# Altium schematic sheet CarteRelais.SchDoc
size A4
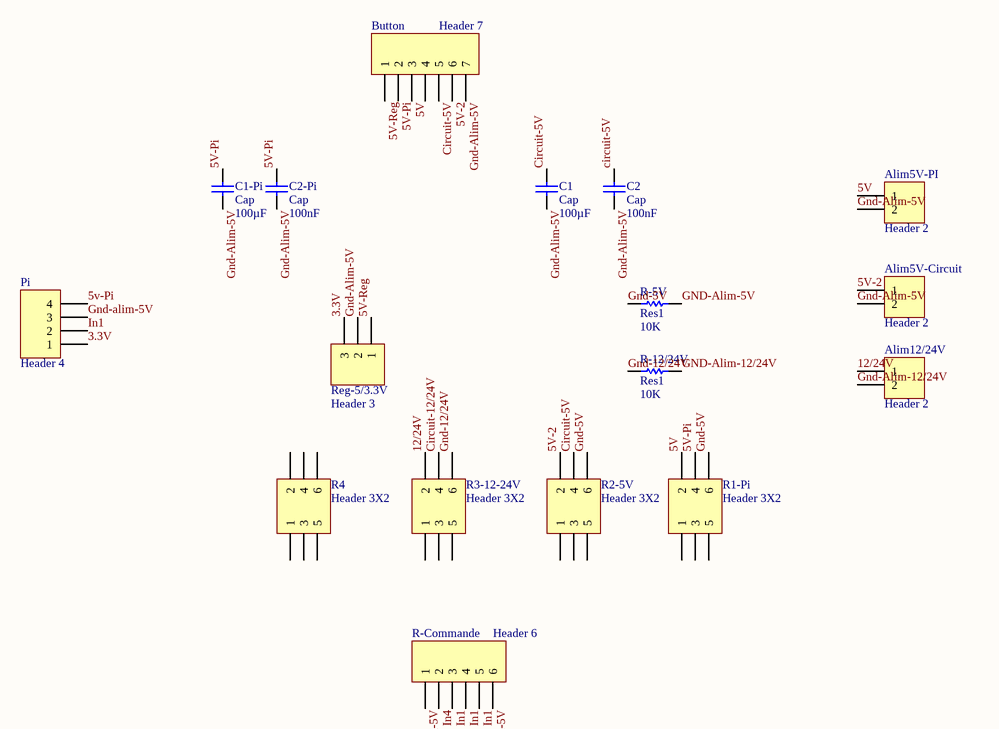
[diagram p0: CarteRelais.SchDoc]

## Parts
Alim5V-Circuit  Header 2  [HDR1X2]
Alim5V-PI  Header 2  [HDR1X2]
Alim12/24V  Header 2  [HDR1X2]
Button  Header 7  [HDR1X7]
C1  Cap  value 100µF  [RAD-0.3]
C1-Pi  Cap  value 100µF  [RAD-0.3]
C2  Cap  value 100nF  [RAD-0.3]
C2-Pi  Cap  value 100nF  [RAD-0.3]
Pi  Header 4  [HDR1X4]
R1-Pi  Header 3X2  [HDR2X3]
R2-5V  Header 3X2  [HDR2X3]
R3-12-24V  Header 3X2  [HDR2X3]
R4  Header 3X2  [HDR2X3]
R-5V  Res1  value 10K  [AXIAL-0.3]
R-12/24V  Res1  value 10K  [AXIAL-0.3]
R-Commande  Header 6  [HDR1X6]
Reg-5/3.3V  Header 3  [HDR1X3]

## Nets
3.3V: Pi.1 Reg-5/3.3V.3
5V: Alim5V-PI.1 Button.3 R1-Pi.2
5V-2: Alim5V-Circuit.1 Button.6 R2-5V.2
5V-Pi: Button.2 C1-Pi.2 C2-Pi.2 Pi.4 R1-Pi.4
5V-Reg: Button.1 Reg-5/3.3V.1
12/24V: Alim12/24V.1 R3-12-24V.2
Circuit-5V: Button.5 C1.2 C2.2 R2-5V.4 R-Commande.1
Circuit-12/24V: R3-12-24V.4
Gnd-5V: R1-Pi.6 R2-5V.6 R-5V.1
Gnd-12/24V: R3-12-24V.6 R-12/24V.1
GND-Alim-5V: Alim5V-Circuit.2 Alim5V-PI.2 Button.7 C1.1 C1-Pi.1 C2.1 C2-Pi.1 Pi.3 R-5V.2 R-Commande.6 Reg-5/3.3V.2
GND-Alim-12/24V: Alim12/24V.2 R-12/24V.2
In1: Pi.2 R-Commande.3 R-Commande.4 R-Commande.5
In4: R-Commande.2

Not connected (* = marked no-connect by the designer): Button 4; R1-Pi 1 3 5; R2-5V 1 3 5; R3-12-24V 1 3 5; R4 1 2 3 4 5 6

## Library data of the parts
Alim5V-Circuit Alim5V-PI Alim12/24V = Header 2: Header, 2-Pin; LatestRevisionDate: 17-Jul-2002; LatestRevisionNote: Re-released for DXP Platform.; Publisher: Altium Limited
Button = Header 7: Header, 7-Pin; LatestRevisionDate: 17-Jul-2002; LatestRevisionNote: Re-released for DXP Platform.; Publisher: Altium Limited
C1 C1-Pi C2 C2-Pi = Cap: Capacitor; Published: 8-Jun-2000; LatestRevisionDate: 17-Jul-2002; LatestRevisionNote: Re-released for DXP Platform.; PackageReference: RAD-0.3; Publisher: Altium Limited; PackageDescription: Radial Cap, Thru-Hole; 2 Leads; 0.3 in Pin Spacing
Pi = Header 4: Header, 4-Pin; LatestRevisionDate: 17-Jul-2002; LatestRevisionNote: Re-released for DXP Platform.; Publisher: Altium Limited
R1-Pi R2-5V R3-12-24V R4 = Header 3X2: Header, 3-Pin, Dual row; LatestRevisionDate: 17-Jul-2002; LatestRevisionNote: Re-released for DXP Platform.; Publisher: Altium Limited
R-5V R-12/24V = Res1: Resistor; Published: 8-Jun-2000; LatestRevisionDate: 17-Jul-2002; LatestRevisionNote: Re-released for DXP Platform.; PackageReference: AXIAL-0.3; Publisher: Altium Limited; PackageDescription: Axial Device, Thru-Hole; 2 Leads; 0.3 in Pin Spacing
R-Commande = Header 6: Header, 6-Pin; LatestRevisionDate: 17-Jul-2002; LatestRevisionNote: Re-released for DXP Platform.; Publisher: Altium Limited
Reg-5/3.3V = Header 3: Header, 3-Pin; LatestRevisionDate: 17-Jul-2002; LatestRevisionNote: Re-released for DXP Platform.; Publisher: Altium Limited